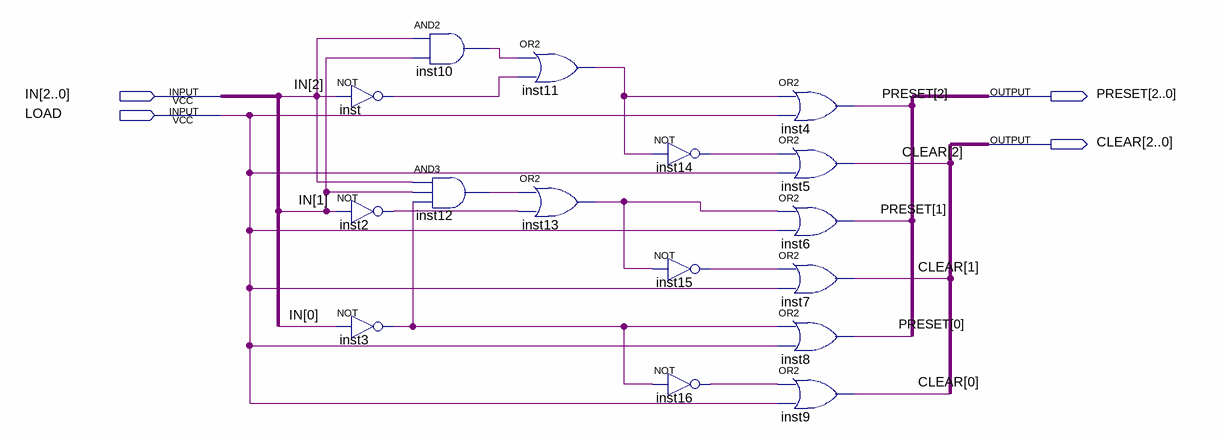
[diagram p0: schematic sheet]
// Quartus schematic MODULE_LOAD.bdf as structural Verilog: 16 symbols, 4 pins
module MODULE_LOAD (
  input  [2:0] IN,
  input  LOAD,
  output [2:0] PRESET,
  output [2:0] CLEAR
);

  wire inst2_out, inst3_out, inst10_out, inst11_out, inst12_out, inst13_out, inst14_out, inst15_out,
       inst16_out, inst_out;

  not inst (inst_out, IN[2]);
  not inst2 (inst2_out, IN[1]);
  not inst3 (inst3_out, IN[0]);
  and inst10 (inst10_out, IN[2], IN[1]);
  and inst12 (inst12_out, IN[2], IN[1], inst3_out);
  or inst11 (inst11_out, inst10_out, inst_out);
  or inst13 (inst13_out, inst12_out, inst2_out);
  not inst14 (inst14_out, inst11_out);
  not inst15 (inst15_out, inst13_out);
  not inst16 (inst16_out, inst3_out);
  or inst4 (PRESET[2], inst11_out, LOAD);
  or inst5 (CLEAR[2], inst14_out, LOAD);
  or inst6 (PRESET[1], inst13_out, LOAD);
  or inst7 (CLEAR[1], inst15_out, LOAD);
  or inst8 (PRESET[0], inst3_out, LOAD);
  or inst9 (CLEAR[0], inst16_out, LOAD);
endmodule
